# Altium schematic sheet PG11_ CAN_CONN.SchDoc: BMU - Battery Connector/CAN
size B; Address1: 3511 EDISON WAY; Address2: MENLO PARK, CA, 94025; DocumentNumber: 1; Revision: 4.1; SheetNumber: 6; SheetTotal: 9
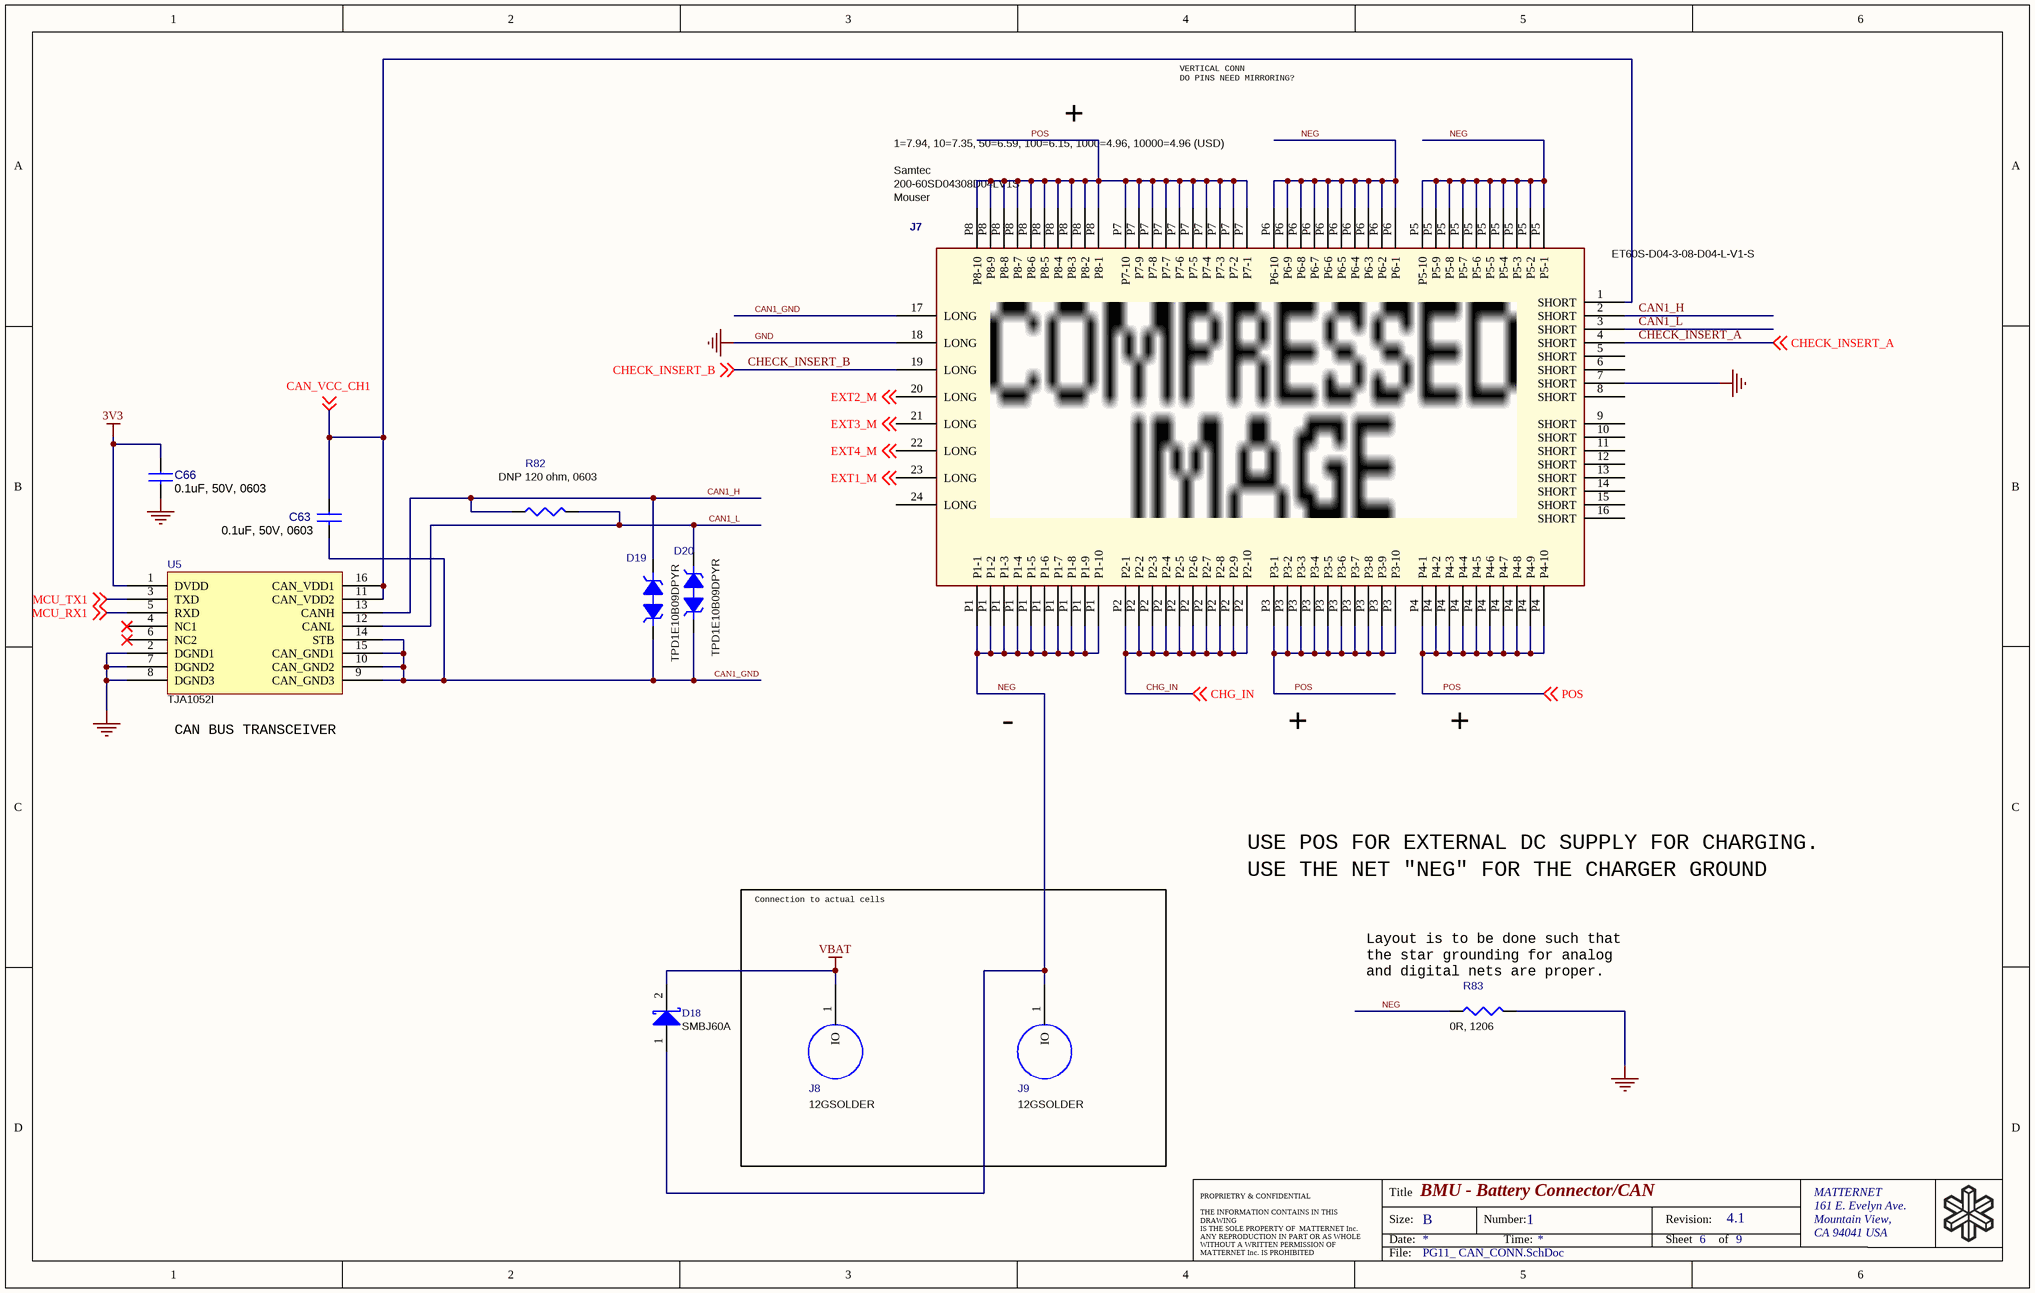
[diagram p0: PG11_ CAN_CONN.SchDoc]

## Parts
C63  0.1uF, 50V, 0603  [C0603]
C66  0.1uF, 50V, 0603  [C0603]
D18  SMBJ60A  [DO-214AA]
D19  TPD1E10B09DPYR  [2X2SON]
D20  TPD1E10B09DPYR  [2X2SON]
J7  ET60S-D04-3-08-D04-L-V1-S  Supplier 1: Mouser  Supplier Part Number 1: 200-60SD04308D04LV1S  Manufacturer: Samtec  Pricing 1: 1=7.94, 10=7.35, 50=6.59, 100=6.15, 1000=4.96, 10000=4.96 (USD)  [ET60S-D04-3-08-D04-L-V1-S]
J8  12GSOLDER  [12GPAD]  (no BOM)
J9  12GSOLDER  [12GPAD]  (no BOM)
R82  DNP 120 ohm, 0603  [R0603]  (no BOM)
R83  0R, 1206  [R1206]
U5  TJA1052I  [16-SOIC]

## Blocks framed on the sheet
Connection to actual cells: J8 J9

## Nets
3V3: C66.1 U5.1(DVDD)
GND: C66.2 J7.7(SHORT) J7.18(LONG) R83.1 U5.2(DGND1) U5.7(DGND2) U5.8(DGND3)
VBAT: D18.2(K) J8.1(IO)
CAN1_GND: C63.2 D19.1 D20.1 J7.17(LONG) U5.9(CAN_GND3) U5.10(CAN_GND2) U5.14(STB) U5.15(CAN_GND1)
CAN1_H: D19.2 J7.2(SHORT) R82.1 U5.13(CANH)
CAN1_L: D20.2 J7.3(SHORT) R82.2 U5.12(CANL)
CAN_VCC_CH1: C63.1 J7.1(SHORT) U5.11(CAN_VDD2) U5.16(CAN_VDD1) ; off-sheet CAN_VCC_CH1
CHECK_INSERT_A: J7.4(SHORT) ; off-sheet CHECK_INSERT_A
CHECK_INSERT_B: J7.19(LONG) ; off-sheet CHECK_INSERT_B
CHG_IN: J7.P2(P2-1) ; off-sheet CHG_IN
EXT1_M: J7.23(LONG) ; off-sheet EXT1_M
EXT2_M: J7.20(LONG) ; off-sheet EXT2_M
EXT3_M: J7.21(LONG) ; off-sheet EXT3_M
EXT4_M: J7.22(LONG) ; off-sheet EXT4_M
MCU_RX1: U5.5(RXD) ; off-sheet MCU_RX1
MCU_TX1: U5.3(TXD) ; off-sheet MCU_TX1
NEG: D18.1(A) J7.P1(P1-1) J7.P5(P5-1) J7.P6(P6-1) J9.1(IO) R83.2
POS: J7.P3(P3-1) J7.P4(P4-1) J7.P7(P7-1) J7.P8(P8-1) ; off-sheet POS

Not connected (* = marked no-connect by the designer): J7 5(SHORT) 6(SHORT) 8(SHORT) 9(SHORT) 10(SHORT) 11(SHORT) 12(SHORT) 13(SHORT) 14(SHORT) 15(SHORT) 16(SHORT) 24(LONG); U5 4(NC1)* 6(NC2)*

## Notes on the sheet
- +
- VERTICAL CONN
  DO PINS NEED MIRRORING?
- (near U5) CAN BUS TRANSCEIVER
- -
- USE POS FOR EXTERNAL DC SUPPLY FOR CHARGING.
- USE THE NET "NEG" FOR THE CHARGER GROUND
- (near R83) Layout is to be done such that the star grounding for analog and digital nets are proper.
- Title
- Size:
- Date:
- B
- Number:
- Time:
- Revision:
- Sheet
- of
- MATTERNET
- 161 E. Evelyn Ave.
- Mountain View,
- CA 94041 USA
- PROPRIETRY & CONFIDENTIAL
  THE INFORMATION CONTAINS IN THIS DRAWING
  IS THE SOLE PROPERTY OF  MATTERNET Inc.
  ANY REPRODUCTION IN PART OR AS WHOLE
  WITHOUT A WRITTEN PERMISSION OF
  MATTERNET Inc. IS PROHIBITED
- File:

## Library data of the parts
C63 C66 = CAP-Generic-0603: CAP CER 0.1UF 50V 10% X7R 0603; Manufacturer: Murata; Manufacturer Part Number: GCJ188R71E104KA12D; Supplier 1: Digi-Key; Supplier Part Number 1: 490-16477-1-ND; Stock 1: 2560; Pricing 1: 1=0.22, 10=0.152, 100=0.077, 500=0.0527, 1000=0.04662 (USD); Case/Package: 0603; Supplier 2: Mouser; Supplier Part Number 2: 81-GCJ188R71E104KA2D; Stock 2: 47905; Pricing 2: 1=0.21, 10=0.139, 50=0.139, 100=0.071, 1000=0.043, 10000=0.035 (USD)
D18 = SMBJ60A: ESD Suppressors / TVS Diodes 60Vr; Manufacturer: Vishay Semiconductors; Manufacturer Part Number: SMBJ60A-E3/52; Clamping Voltage: 96.8V; Peak Pulse Power: 600W; Direction: Unidirectional; Reverse Standoff Voltage: 60V; Peak Pulse Current: 6.2A; Test Current: 1mA; Min Breakdown Voltage: 66.7V; Max Reverse Leakage Current: 1uA; Element Configuration: Single; Number of Elements: 1; Max Breakdown Voltage: 73.7V; ESD Protection: No; Supplier 1: Mouser; Supplier Part Number 1: 625-SMBJ60A-E3; Stock 1: 9885; Pricing 1: 1=0.52, 10=0.301, 50=0.301, 100=0.175, 1000=0.11, 10000=0.083 (USD); Mount: Surface Mount; Case/Package: SMB; Number of Pins: 2; Contact Plating: Matte,Tin; Min Operating Temperature: -55°C; Max Operating Temperature: 150°C; Packaging: Tape and Reel; Package Quantity: 750; Polarity: Unidirectional; Power Dissipation: 600W; Max Surge Current: 6.2A; Reverse Breakdown Voltage: 66.7V; Breakdown Voltage: 66.7V; Leakage Current: 1uA; Termination: SMD/SMT; Max Power Dissipation: 600W; Operating Supply Voltage: 60V; Number of Channels: 1; Length: 5.59mm; Height: 2.44mm; Width: 3.94mm; Radiation Hardening: No; Lead Free: Lead Free; ComponentLink1URL: http://media.digikey.com/pdf/Data%20Sheets/Vishay%20Semiconductors/SMBJ5.0A_thru_188A.pdf?src-supplier=Digi-Key; ComponentLink1Description: http://media.digikey.com/pdf/Data%20Sheets/Vishay%20Semiconductors/SMBJ5.0A_thru_188A.pdf?src-supplier=Digi-Key; ComponentLink2URL: http://www.vishay.com/docs/88392/smbj.pdf?src-supplier=Digi-Key; ComponentLink2Description: http://www.vishay.com/docs/88392/smbj.pdf?src-supplier=Digi-Key; ComponentLink3URL: https://www.verical.com/server-webapp/html/getDatasheet?partID=84761&src-supplier=Verical; ComponentLink3Description: https://www.verical.com/server-webapp/html/getDatasheet?partID=84761&src-supplier=Verical; ComponentLink4URL: http://components.arrow.com/part/dataview/42825922S9422245N5680?src-supplier=Arrow; ComponentLink4Description: http://components.arrow.com/part/dataview/42825922S9422245N5680?src-supplier=Arrow; Supplier 2: Digi-Key; Supplier Part Number 2: SMBJ60A-E3/52GIDKR-ND; Stock 2: 2980; Pricing 2: 1=0.37, 10=0.296, 25=0.2712, 100=0.2018, 250=0.18284 (USD)
D19 D20 = ESD BI-DIR TRIG 9VDC 0402_0: TVS DIODE 9VWM 20VC 2X2SON; Manufacturer: Texas Instruments; custinv: Ansync; custprt: 100-0500-000170; Option: AB; Direction: Bidirectional; Capacitance: 10pF; Number of Channels: 1; Reverse Standoff Voltage: 9V; Clamping Voltage: 20V; Peak Pulse Power: 90W; Power Line Protection: No; Breakdown Voltage: 9.5V; Leakage Current: 100nA; ESD Protection: Yes; Test Current: 1mA; Element Configuration: Single; Peak Pulse Current: 4.5A; TYPE: Diode; Supplier 1: Digi-Key; Supplier Part Number 1: 296-30405-1-ND; Manufacturer Part Number: TPD1E10B09DPYR; Stock 1: 89820; Pricing 1: 1=0.45, 10=0.336, 100=0.2096, 500=0.1434, 1000=0.11031 (USD); Case/Package: 0402; Number of Pins: 2; Contact Plating: Gold; Min Operating Temperature: -40°C; Max Operating Temperature: 125°C; Packaging: Tape and Reel; Package Quantity: 1; Number of Bidirectional Channels: 1; Min Breakdown Voltage: 9V; Working Voltage: 9V; Max Reverse Leakage Current: 100nA; Operating Supply Voltage: 9V; Composition: Zener; Length: 1.1mm; Height: 0.4mm; Width: 0.7mm; Radiation Hardening: No; REACH SVHC: No SVHC; Lead Free: Lead Free; ComponentLink1URL: http://www.ti.com/general/docs/lit/getliterature.tsp?genericPartNumber=TPD1E10B09&&fileType=pdf; ComponentLink1Description: http://www.ti.com/general/docs/lit/getliterature.tsp?genericPartNumber=TPD1E10B09&&fileType=pdf; ComponentLink2URL: http://www.ti.com/lit/ds/sllseb0b/sllseb0b.pdf; ComponentLink2Description: http://www.ti.com/lit/ds/sllseb0b/sllseb0b.pdf; ComponentLink3URL: http://www.ti.com/lit/ds/symlink/tpd1e10b09.pdf; ComponentLink3Description: http://www.ti.com/lit/ds/symlink/tpd1e10b09.pdf
J7 = ET60S-D04-3-08-D04-L-V1-S: EXtreme Ten60 Power Connector; custprt: ET60S-D04-3-08-D04-L-V1-S; custinv: Samtec; Manufacturer Part Number: ET60S-D04-3-08-D04-L-V1-S; Stock 1: 0; Supplier 2: Farnell; Supplier Part Number 2: 2731048; Stock 2: 0
J8 J9 = 12GSOLDER: Option: AB
R82 = R-Generic-0603: custprt: 100-0100-000119; custinv: Ansync; Option: C
R83 = R-Generic-1206: RES SMD 0 OHM JUMPER 1/4W 1206; Manufacturer: Yageo; Manufacturer Part Number: RC1206JR-070RL; custinv: Ansync; custprt: 100-0100-000016; Option: AB; Resistance: 0mR; Power Rating: 250mW; Tolerance: 5%; Voltage Rating: 200V; Temperature Coefficient: 200ppm/°C; Supplier 1: Digi-Key; Supplier Part Number 1: 311-0.0ERCT-ND; Stock 1: 4537898; Pricing 1: 1=0.1, 10=0.067, 25=0.0484, 50=0.0368, 100=0.0271, 250=0.02068, 500=0.01656, 1000=0.01218 (USD); Case/Package: 1206; Contact Plating: Matte,Tin; Case Code (Metric): 3216; Case Code (Imperial): 1206; Min Operating Temperature: -55°C; Max Operating Temperature: 155°C; Composition: Carbon Film,Thick Film; Packaging: Tape and Reel; Package Quantity: 5000; Number of Terminations: 2; Termination: SMD/SMT; Military Standard: Not; Max Power Dissipation: 250mW; Length: 3.1mm; Height: 0.026inch; Width: 0.063inch; Depth: 1.6mm; Radiation Hardening: No; REACH SVHC: Unknown; Lead Free: Lead Free; ComponentLink1URL: http://www.farnell.com/datasheets/1692832.pdf; ComponentLink1Description: http://www.farnell.com/datasheets/1692832.pdf; ComponentLink2URL: http://www.farnell.com/datasheets/444357.pdf; ComponentLink2Description: http://www.farnell.com/datasheets/444357.pdf; ComponentLink3URL: http://www.yageo.com/documents/recent/PYu-RC1206_51_RoHS_L-4.pdf; ComponentLink3Description: http://www.yageo.com/documents/recent/PYu-RC1206_51_RoHS_L-4.pdf; ComponentLink4URL: http://www.yageo.com/documents/recent/PYu-RC_Group_51_RoHS_L_9.pdf; ComponentLink4Description: http://www.yageo.com/documents/recent/PYu-RC_Group_51_RoHS_L_9.pdf; ComponentLink5URL: http://documents.rs-components.com/techlib://itc_doclist_GB.htm?stockno=6182243; ComponentLink5Description: http://documents.rs-components.com/techlib://itc_doclist_GB.htm?stockno=6182243; ComponentLink6URL: http://www.produktinfo.conrad.com/datenblaetter/400000-424999/402222-da-01-en-SMD_WIDERSTAND_0_OHM_1206.pdf; ComponentLink6Description: http://www.produktinfo.conrad.com/datenblaetter/400000-424999/402222-da-01-en-SMD_WIDERSTAND_0_OHM_1206.pdf
U5 = TJA1052I: CAN Bus, Transceiver SOIC; Manufacturer: NXP Semiconductors; Manufacturer Part Number: TJA1052IT/5Y; Max Supply Voltage: 5.25V; Number of Transmit Buffers: 1; Min Supply Voltage: 3V; Data Rate: 5Mbps; Number of Channels: 2; Channel Type: Unidirectional; Isolated Power: No; Supplier 1: Digi-Key; Supplier Part Number 1: 568-11942-1-ND; Stock 1: 1928; Pricing 1: 1=5.27, 10=4.732, 100=3.8768, 500=3.30026 (USD); Case/Package: SOIC; Number of Pins: 16; Min Operating Temperature: -40°C; Max Operating Temperature: 125°C; Number of Receive Buffers: 1; Packaging: Cut Tape; Interface: CAN; Number of Transceivers: 1; Radiation Hardening: No; REACH SVHC: No SVHC; ComponentLink1URL: http://www.farnell.com/datasheets/2045698.pdf; ComponentLink1Description: http://www.farnell.com/datasheets/2045698.pdf; ComponentLink2URL: http://www.nxp.com/documents/data_sheet/TJA1052I.pdf; ComponentLink2Description: http://www.nxp.com/documents/data_sheet/TJA1052I.pdf